# EAGLE design board1 (EAGLE 5.12)
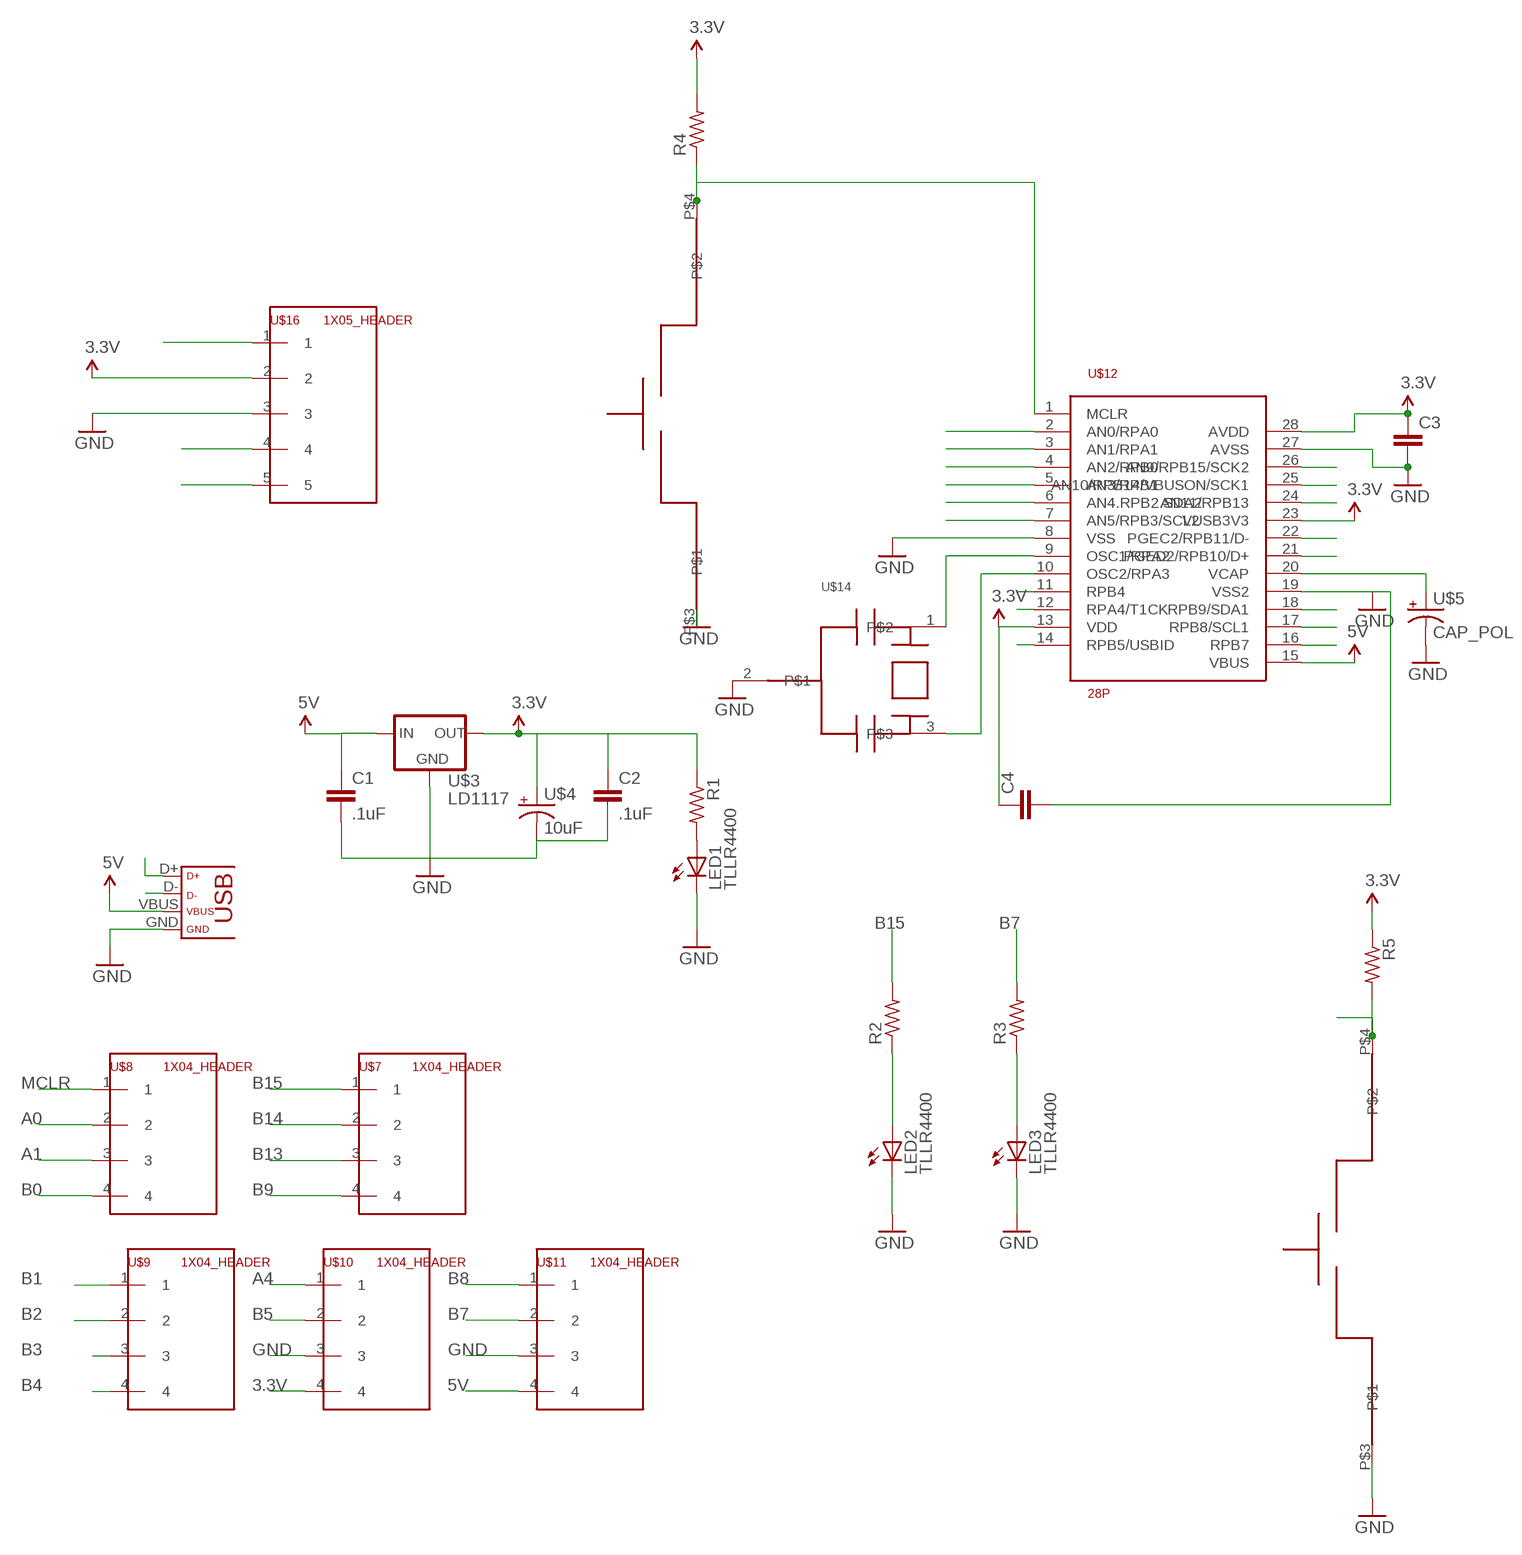
[diagram p0: schematic, sheet 1]

## Parts
C1  .1uF  C2.5/2  [C2.5-2]
C2  .1uF  C2.5/2  [C2.5-2]
C3  C2.5/2  [C2.5-2]
C4  C2.5/2  [C2.5-2]
LED1  TLLR4400  [LED3MM]
LED2  TLLR4400  [LED3MM]
LED3  TLLR4400  [LED3MM]
R1  R-US_M3216  [M3216]
R2  R-US_M3216  [M3216]
R3  R-US_M3216  [M3216]
R4  R-US_M3216  [M3216]
R5  R-US_M3216  [M3216]
U$1  USB  [USB-MINIB]
U$3  LD1117  [TO220]
U$4  10uF  CAP_POL  [CAP_POL_D]
U$5  CAP_POL  [CAP_POL_D]
U$7  1X04_HEADER  [1X04]
U$8  1X04_HEADER  [1X04]
U$9  1X04_HEADER  [1X04]
U$10  1X04_HEADER  [1X04]
U$11  1X04_HEADER  [1X04]
U$12  28P  [DIL28-3]
U$13  SWITCH  [SWITCH]
U$14  8MHZ_RESONATOR  [HC49U]
U$16  1X05_HEADER  [1X05]
U$17  SWITCH  [SWITCH]

## Nets
3.3V: C2.1 C3.1 C4.1 R1.1 R4.2 R5.1 U$3.2(OUT) U$4.1(+) U$10.4 U$12.13(VDD) U$12.23(VUSB3V3) U$12.28(AVDD) U$16.2
5V: C1.1 U$1.VBUS U$3.3(IN) U$11.4 U$12.15(VBUS)
A0: U$8.2 U$12.2(AN0/RPA0)
A1: U$8.3 U$12.3(AN1/RPA1)
A4: U$10.1 U$12.12(RPA4/T1CK)
B0: U$8.4 U$12.4(AN2/RPB0) U$16.4
B1: U$9.1 U$12.5(AN3/RPB1) U$16.5
B2: U$9.2 U$12.6(AN4.RPB2.SDA2)
B3: U$9.3 U$12.7(AN5/RPB3/SCL2)
B4: U$9.4 U$12.11(RPB4)
B5: U$10.2 U$12.14(RPB5/USBID)
B7: R3.2 U$11.2 U$12.16(RPB7)
B8: U$11.1 U$12.17(RPB8/SCL1)
B9: U$7.4 U$12.18(RPB9/SDA1)
B13: R5.2 U$7.3 U$12.24(AN11/RPB13) U$17.P$4
B14: U$7.2 U$12.25(AN10/RPB14/VBUSON/SCK1)
B15: R2.2 U$7.1 U$12.26(AN9/RPB15/SCK2)
D+: U$1.D+ U$12.21(PGED2/RPB10/D+)
D-: U$1.D- U$12.22(PGEC2/RPB11/D-)
GND: C1.2 C3.2 C4.2 LED1.K(C) LED2.K(C) LED3.K(C) U$1.GND U$3.1(GND) U$4.2(-) U$5.2(-) U$10.3 U$11.3 U$12.8(VSS) U$12.19(VSS2) U$12.27(AVSS) U$13.P$3 U$14.2 U$16.3 U$17.P$3
MCLR: R4.1 U$8.1 U$12.1(MCLR) U$13.P$4 U$16.1
N$3: U$12.9(OSC1/RPA2) U$14.1
N$12: U$12.10(OSC2/RPA3) U$14.3
N$23: LED1.A R1.2
N$24: LED2.A R2.1
N$25: LED3.A R3.1
N$26: U$5.1(+) U$12.20(VCAP)
Unconnected: C2.2

## Library data of the parts
C1-C4 = capacitor-wima:C: CAPACITOR naming: grid - package width
LED1-LED3 = myboard:TLLR4400: Low Current (2mA) LED 3 mm Tinted Diffused Package color RED Source: Data sheet <http://www.farnell.com/datasheets/391100.pdf>; MF: VISHAY SEMICONDUCTOR; OC_FARNELL: 1612437
R1-R5 = resistor:R-US_: RESISTOR, American symbol
U$1 = myboard:USB
U$3 = ME433:LD1117
U$4 U$5 = ME433:CAP_POL
U$7-U$11 = ME433:1X04_HEADER
U$12 = myboard:28P
U$13 U$17 = myboard:SWITCH
U$14 = myboard:8MHZ_RESONATOR
U$16 = ME433:1X05_HEADER

## Board
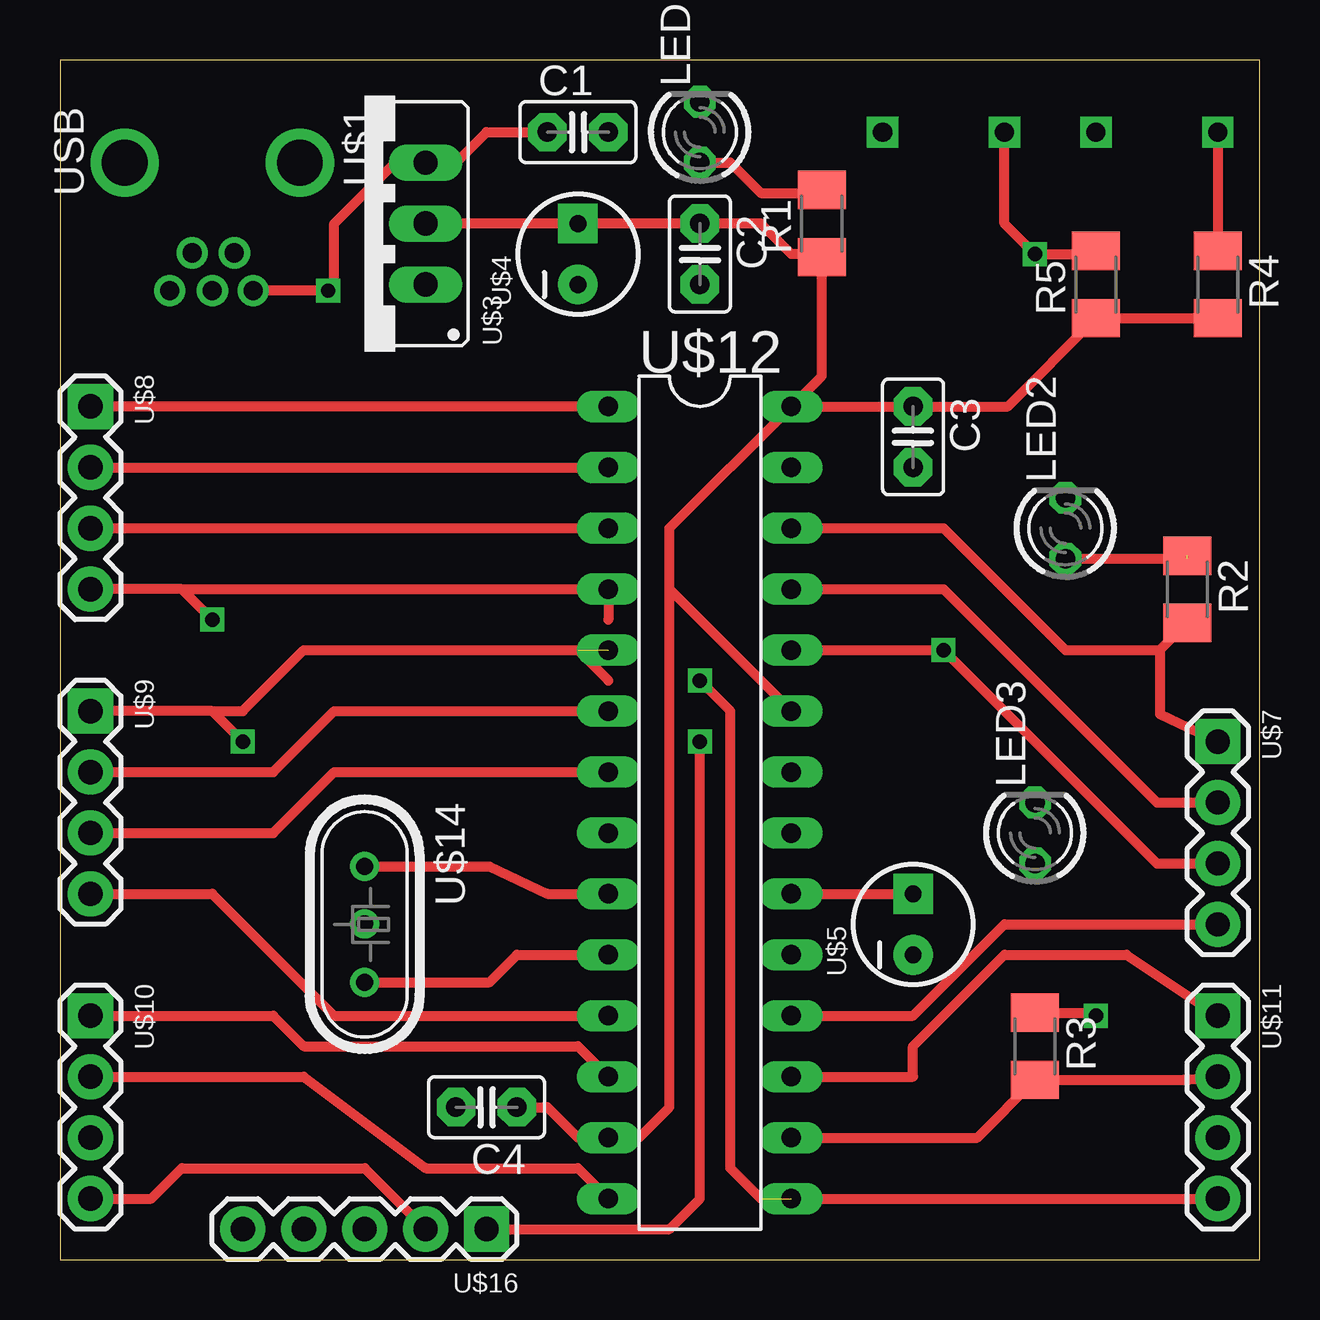
[diagram p1: board, top side]
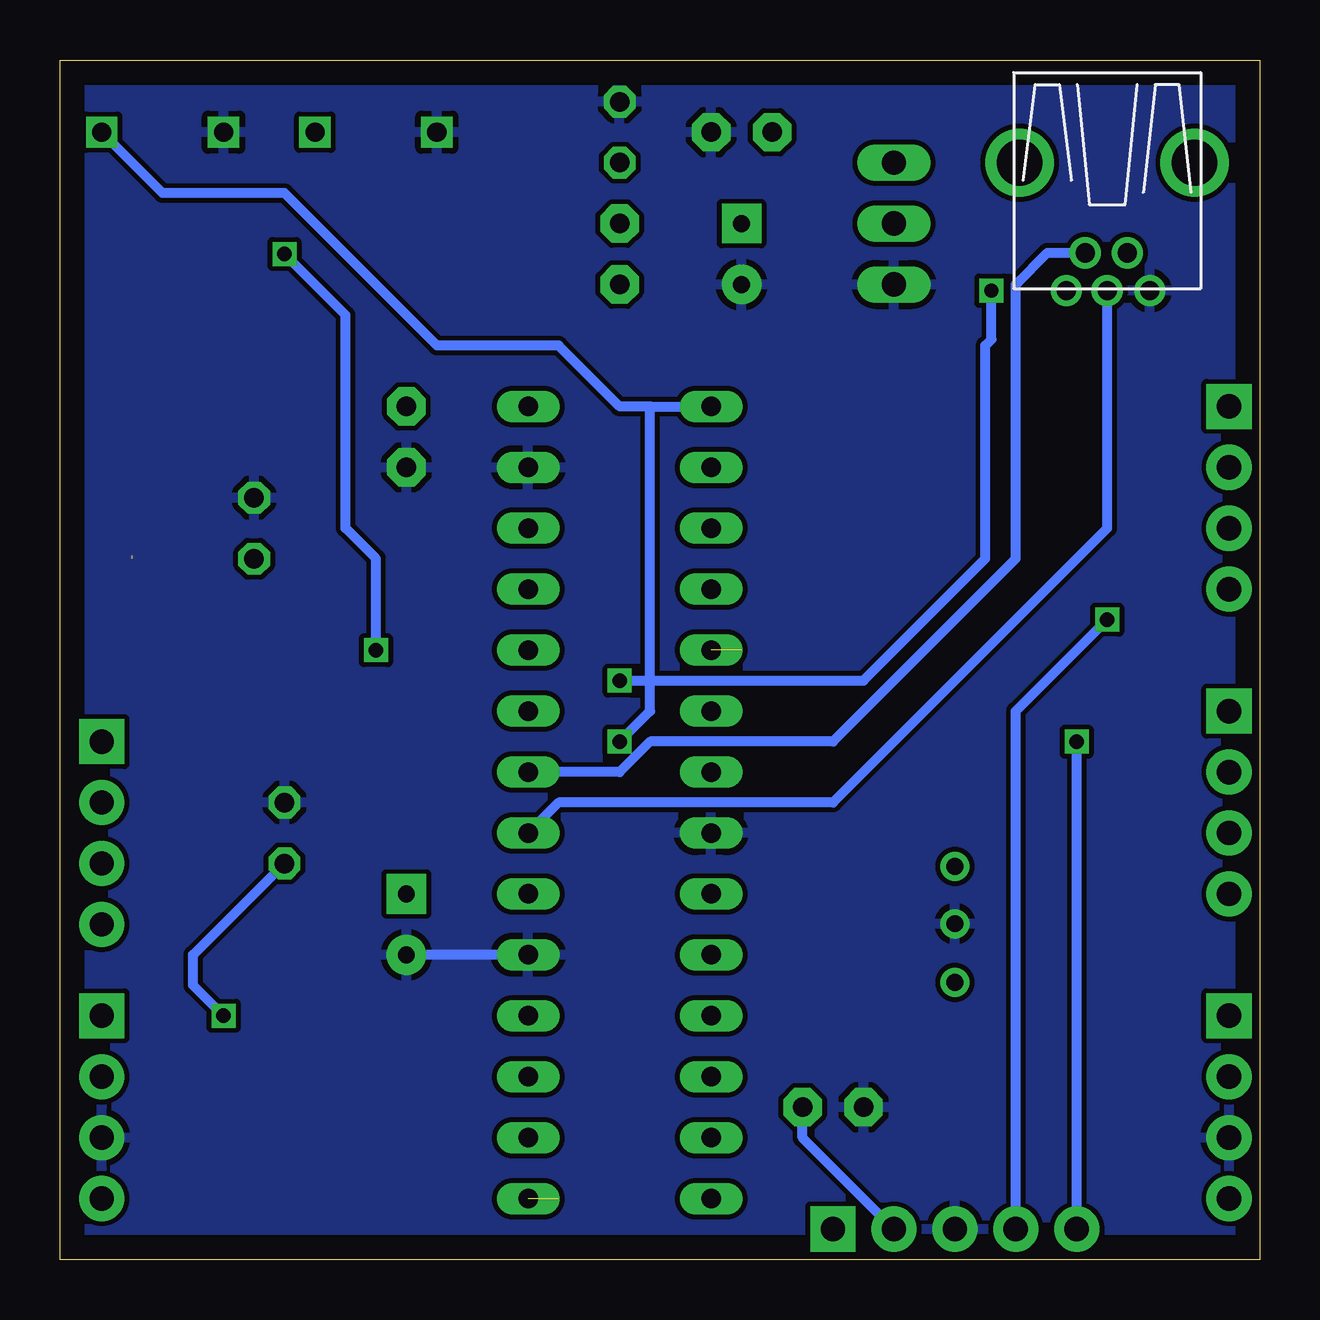
[diagram p2: board, bottom side, seen from below]

Size 50 x 50 mm. Coordinates in mm from the lower left corner, seen from the top.
Outline: 0,0 50,0 50,50 0,50 0,0
Copper layers (1*16): Top 0.035mm / dielectric 1.5mm / Bottom 0.035mm
Design rules "default": minimum track width 10mil, minimum drill 24mil, track to track 8mil, track to pad 8mil, pad to pad 8mil, via to via 8mil, smd to smd 8mil, copper to edge 40mil, drill to drill 8mil, minimum pad ring 10mil, minimum via ring 8mil, stop-mask expansion 4mil, vias tented up to drill 0mil, thermal gap 10mil

### Footprints (pad centres in the part's own frame; a part is rotated, then mirrored left to right if it is on the bottom)
C2.5-2 = drill 0.813 pad 1.6 octagon: 1 -1.27,0; 2 1.27,0
LED3MM = drill 0.813 octagon: A -1.27,0; K 1.27,0
M3216 = smd 1.6 x 2: 1 -1.4,0; 2 1.4,0
USB-MINIB = drill 0.8 round: D+ 4.064,0; D- 2.489,0.914; GND 4.064,-1.778; ID 2.489,-0.838; VBUS 4.064,1.702 | drill 1.9 round: P$6 -1.27,-3.65; P$7 -1.27,3.65
TO220 = drill 1.016 long: 1 -2.54,0; 2 0,0; 3 2.54,0
CAP_POL_D = drill 0.7 pad 1.651 square: 1 1.27,0 | drill 0.7 pad 1.651 round: 2 -1.27,0
1X04 = drill 1.016 pad 1.88 square: 1 0,0 | drill 1.016 pad 1.88 round: 2 2.54,0; 3 5.08,0; 4 7.62,0
DIL28-3 = drill 0.813 long: 1 -16.51,-3.81; 2 -13.97,-3.81; 3 -11.43,-3.81; 4 -8.89,-3.81; 5 -6.35,-3.81; 6 -3.81,-3.81; 7 -1.27,-3.81; 8 1.27,-3.81; 9 3.81,-3.81; 10 6.35,-3.81; 11 8.89,-3.81; 12 11.43,-3.81; 13 13.97,-3.81; 14 16.51,-3.81; 15 16.51,3.81; 16 13.97,3.81; 17 11.43,3.81; 18 8.89,3.81; 19 6.35,3.81; 20 3.81,3.81; 21 1.27,3.81; 22 -1.27,3.81; 23 -3.81,3.81; 24 -6.35,3.81; 25 -8.89,3.81; 26 -11.43,3.81; 27 -13.97,3.81; 28 -16.51,3.81
SWITCH = drill 0.8 square: P$3 -2.54,0; P$4 2.54,0
HC49U = drill 0.7 pad 1.2 round: 1 -2.413,0; 2 -0.027,0; 3 2.413,0
1X05 = drill 1.016 pad 1.88 square: 1 0,0 | drill 1.016 pad 1.88 round: 2 2.54,0; 3 5.08,0; 4 7.62,0; 5 10.16,0

### Placement (x,y rotation side)
C1  21.59,46.99 0 top
C2  26.67,41.91 270 top
C3  35.56,34.29 270 top
C4  17.78,6.35 180 top
LED1  26.67,46.99 90 top
LED2  41.91,30.48 90 top
LED3  40.64,17.78 90 top
R1  31.75,43.18 90 top
R2  46.99,27.94 270 top
R3  40.64,8.89 270 top
R4  48.26,40.64 270 top
R5  43.18,40.64 90 top
U$1  6.35,44.45 270 top
U$3  15.24,43.18 90 top
U$4  21.59,41.91 90 top
U$5  35.56,13.97 90 top
U$7  48.26,21.59 270 top
U$8  1.27,35.56 270 top
U$9  1.27,22.86 270 top
U$10  1.27,10.16 270 top
U$11  48.26,10.16 270 top
U$12  26.67,19.05 270 top
U$13  45.72,46.99 0 top
U$14  12.7,13.97 270 top
U$16  17.78,1.27 180 top
U$17  36.83,46.99 0 top

### Tracks (layer width: path | path; a pad name or v marks a point on that pad's centre or on a via)
3.3V
  Top 0.406: C4.1 20.32,6.35 21.59,5.08 U$12.13 24.13,5.08 25.4,6.35 25.4,27.94 | U$3.2 U$4.1 C2.1 29.21,43.18 30.48,41.91 31.62,41.91 R1.1 31.75,36.83 U$12.28 | U$12.28 C3.1 39.5,35.56 R5.1 R4.2 | 25.4,27.94 25.4,30.48 U$12.28 | 25.4,27.94 U$12.23 | U$10.4 3.81,2.54 5.08,3.81 12.7,3.81 U$16.2
  Bottom 0.406: C4.1 19.05,5.08 U$16.2
5V  (via drill 0.6)  (1 unrouted)
  Top 0.406: U$1.VBUS v11.18,40.39 11.43,40.64 11.43,43.18 13.97,45.72 U$3.3 16.51,45.72 17.78,46.99 C1.1 | U$12.15 U$11.4 | v26.67,24.13 27.94,22.86 27.94,3.81 29.21,2.54
  Bottom 0.406: v11.18,40.39 11.18,38.35 11.43,38.1 11.43,29.21 16.51,24.13 v26.67,24.13
A0
  Top 0.406: U$8.2 U$12.2
A1
  Top 0.406: U$8.3 U$12.3
A4
  Top 0.406: U$10.1 8.89,10.16 10.16,8.89 21.59,8.89 U$12.12
B0  (via drill 0.6)
  Top 0.406: 5.08,27.94 U$8.4 | 5.08,27.94 U$12.4 22.86,26.67 | v6.35,26.67 5.08,27.94
  Bottom 0.406: U$16.4 10.16,22.86 v6.35,26.67
B1  (via drill 0.6)  (1 unrouted)
  Top 0.406: 6.35,22.86 U$9.1 | 6.35,22.86 7.62,22.86 10.16,25.4 21.59,25.4 22.86,24.13 | v7.62,21.59 6.35,22.86
  Bottom 0.406: U$16.5 v7.62,21.59
B2
  Top 0.406: U$9.2 8.89,20.32 11.43,22.86 U$12.6
B3
  Top 0.406: U$9.3 8.89,17.78 11.43,20.32 U$12.7
B4
  Top 0.406: U$9.4 6.35,15.24 11.43,10.16 U$12.11
B5
  Top 0.406: U$10.2 10.16,7.62 15.24,3.81 21.59,3.81 U$12.14
B7
  Top 0.406: U$12.16 38.23,5.08 R3.2 46.86,7.49 U$11.2
B8
  Top 0.406: U$12.17 35.56,7.62 35.56,8.89 39.37,12.7 44.45,12.7 U$11.1
B9
  Top 0.406: U$12.18 35.56,10.16 39.37,13.97 U$7.4
B13  (via drill 0.6)
  Top 0.406: U$17.P$4 39.37,43.18 v40.64,41.91 43.05,41.91 R5.2 | U$12.24 v36.83,25.4 45.72,16.51 U$7.3
  Bottom 0.406: v36.83,25.4 36.83,29.21 38.1,30.48 38.1,39.37 v40.64,41.91
B14
  Top 0.406: U$12.25 36.83,27.94 45.72,19.05 U$7.2
B15
  Top 0.406: U$12.26 36.83,30.48 41.91,25.4 45.85,25.4 | 45.85,25.4 R2.2 | 45.85,25.4 45.85,22.73 U$7.1
D+
  Bottom 0.406: U$1.D+ 6.35,30.48 17.78,19.05 29.21,19.05 U$12.21
D-
  Bottom 0.406: U$1.D- 8.84,41.96 10.16,40.64 10.16,29.21 17.78,21.59 25.4,21.59 26.67,20.32 U$12.22
GND
  Bottom 0.406: U$12.19 U$5.2
  pour Bottom: 0,49.53 49.53,49.53 50.8,49.53 50.8,0 0,0
MCLR  (via drill 0.6)
  Top 0.406: U$12.1 U$8.1 | U$13.P$4 R4.1 | U$16.1 25.4,1.27 26.67,2.54 v26.67,21.59
  Bottom 0.406: 25.4,35.56 U$12.1 | 25.4,35.56 26.67,35.56 29.21,38.1 34.29,38.1 40.64,44.45 45.72,44.45 U$13.P$4 | v26.67,21.59 25.4,22.86 25.4,35.56
N$3
  Top 0.406: U$14.1 17.91,16.38 20.32,15.24 U$12.9
N$12
  Top 0.406: U$14.3 17.91,11.56 19.05,12.7 U$12.10
N$23
  Top 0.406: LED1.A 27.94,45.72 29.21,44.45 31.62,44.45 R1.2
N$24  (1 unrouted)
  Top 0.406: LED2.A 46.99,29.21
N$25  (via drill 0.6)
  Top 0.406: R3.1 43.05,10.29 v43.18,10.16
  Bottom 0.406: v43.18,10.16 44.45,11.43 44.45,12.7 LED3.A
N$26
  Top 0.406: U$12.20 U$5.1